# EAGLE design EOH-Badge-2016 (EAGLE 7.2.0)
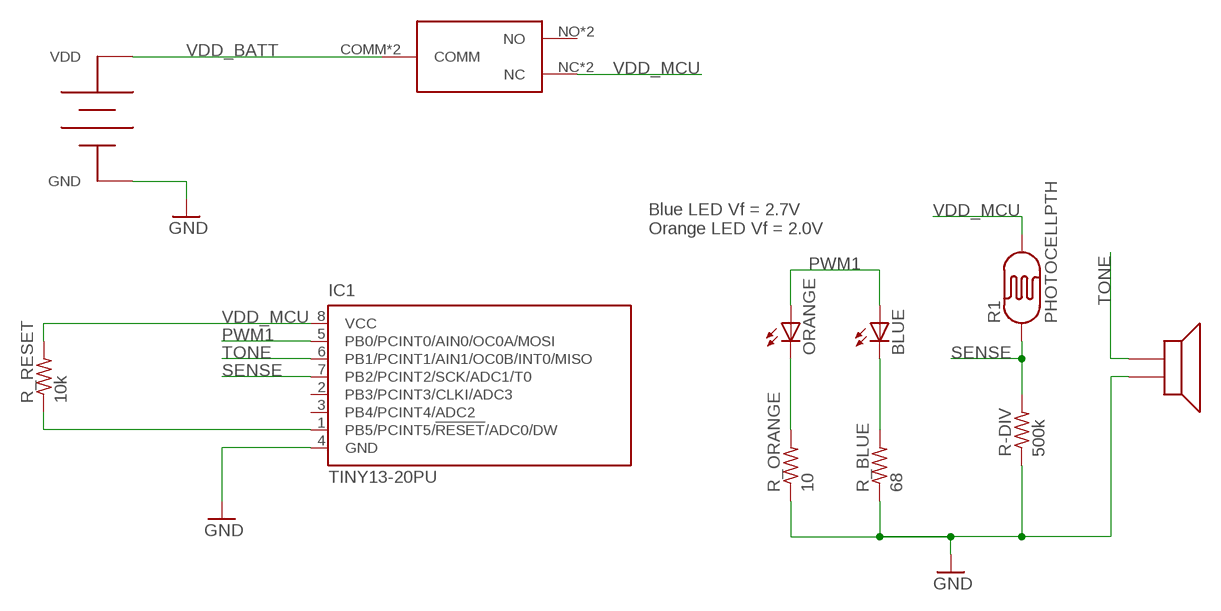
[diagram p0: schematic, sheet 1]

## Parts
BLUE  LED5MM  [LED5MM]
IC1  TINY13-20PU  [DIL08]
ORANGE  LED5MM  [LED5MM]
R1  PHOTOCELLPTH  [PHOTOCELL]
R-DIV  500k  R-US_0207/12  [0207/12]
R_BLUE  68  R-US_0207/12  [0207/12]
R_ORANGE  10  R-US_0207/12  [0207/12]
R_RESET  10k  R-US_0207/12  [0207/12]
U$1  MPD-BH32T-C  [MPD-BC2032-E2]
U$2  PIEZO  [PS1240P02BT]
U$3  EG1919-SW  [EG1919-SW]

## Nets
GND: IC1.4(GND) R-DIV.1 R_BLUE.1 R_ORANGE.1 U$1.NEG(GND) U$2.GND
N$1: IC1.1(PB5/PCINT5/!RESET!/ADC0/DW) R_RESET.1
N$2: ORANGE.K(C) R_ORANGE.2
N$3: BLUE.K(C) R_BLUE.2
PWM1: BLUE.A IC1.5(PB0/PCINT0/AIN0/OC0A/MOSI) ORANGE.A
SENSE: IC1.7(PB2/PCINT2/SCK/ADC1/T0) R1.1 R-DIV.2
TONE: IC1.6(PB1/PCINT1/AIN1/OC0B/INT0/MISO) U$2.AUDIO
VDD_BATT: U$1.POS(VDD) U$3.COMM U$3.COMM2(COMM)
VDD_MCU: IC1.8(VCC) R1.2 R_RESET.2 U$3.NC U$3.NC2(NC)
Unconnected: IC1.2(PB3/PCINT3/CLKI/ADC3) IC1.3(PB4/PCINT4/ADC2) U$3.NO U$3.NO2(NO)

## Notes on the sheet
- Blue LED Vf = 2.7V
  Orange LED Vf = 2.0V

## Library data of the parts
BLUE ORANGE = led:LED: LED OSRAM: - CHIPLED LG R971, LG N971, LY N971, LG Q971, LY Q971, LO R971, LY R971 LH N974, LH R974 LS Q976, LO Q976, LY Q976 LO Q996 - Hyper CHIPLED LW Q18S LB Q993, LB Q99A, LB R99A - SideLED LS A670, LO A670, LY A670, LG A670, LP A670 LB A673, LV A673, LT A673, LW A673 LH A674 LY A675 LS A676, LA A676, LO A676, LY A676, LW A676 LS A679, LY A679, LG A679 - Hyper Micro SIDELED® LS Y876, LA Y876, LO Y876, LY Y876 LT Y87S - SmartLED LW L88C, LW L88S LB L89C, LB L89S, LG L890 LS L89K, LO L89K, LY L89K LS L896, LA L896, LO L896, LY L896 - TOPLED LS T670, LO T670, LY T670, LG T670, LP T670 LSG T670, LSP T670, LSY T670, LOP T670, LYG T670 LG T671, LOG T671, LSG T671 LB T673, LV T673, LT T673, LW T673 LH T674 LS T676, LA T676, LO T676, LY T676, LB T676, LH T676, LSB T676, LW T676 LB T67C, LV T67C, LT T67C, LS T67K, LO T67K, LY T67K, LW E67C LS E67B, LA E67B, LO E67B, LY E67B, LB E67C, LV E67C, LT E67C LW T67C LS T679, LY T679, LG T679 LS T770, LO T770, LY T770, LG T770, LP T770 LB T773, LV T773, LT T773, LW T773 LH T774 LS E675, LA E675, LY E675, LS T675 LS T776, LA T776, LO T776, LY T776, LB T776 LHGB T686 LT T68C, LB T68C - Hyper Mini TOPLED® LB M676 - Mini TOPLED Santana® LG M470 LS M47K, LO M47K, LY M47K Source: http://www.osram.convergy.de LUXEON: - LUMILED® LXK2-PW12-R00, LXK2-PW12-S00, LXK2-PW14-U00, LXK2-PW14-V00 LXK2-PM12-R00, LXK2-PM12-S00, LXK2-PM14-U00 LXK2-PE12-Q00, LXK2-PE12-R00, LXK2-PE12-S00, LXK2-PE14-T00, LXK2-PE14-U00 LXK2-PB12-K00, LXK2-PB12-L00, LXK2-PB12-M00, LXK2-PB14-N00, LXK2-PB14-P00, LXK2-PB14-Q00 LXK2-PR12-L00, LXK2-PR12-M00, LXK2-PR14-Q00, LXK2-PR14-R00 LXK2-PD12-Q00, LXK2-PD12-R00, LXK2-PD12-S00 LXK2-PH12-R00, LXK2-PH12-S00 LXK2-PL12-P00, LXK2-PL12-Q00, LXK2-PL12-R00 Source: www.luxeon.com KINGBRIGHT: KA-3528ASYC Source: www.kingbright.com
IC1 = atmel:TINY13: 8-bit AVR Microcontroller with 1K Bytes In-System Programmable Flash Source: http://www.atmel.com/dyn/resources/prod_documents/2535S.pdf; MPN: ATTINY13-20PU; OC_FARNELL: 9171550; OC_NEWARK: 96K6521
R1 = SparkFun-Sensors:PHOTOCELL: CdS photoresistor. This is a low cost way to detect light levels. Resistance decreases with more incoming light. SparkFun SKU: SEN-09088
R-DIV R_BLUE R_ORANGE R_RESET = resistor:R-US_: RESISTOR, American symbol
U$1 = eoh-16:MPD-BH32T-C
U$2 = eoh-16:PIEZO
U$3 = eoh-16:EG1919-SW

## Board
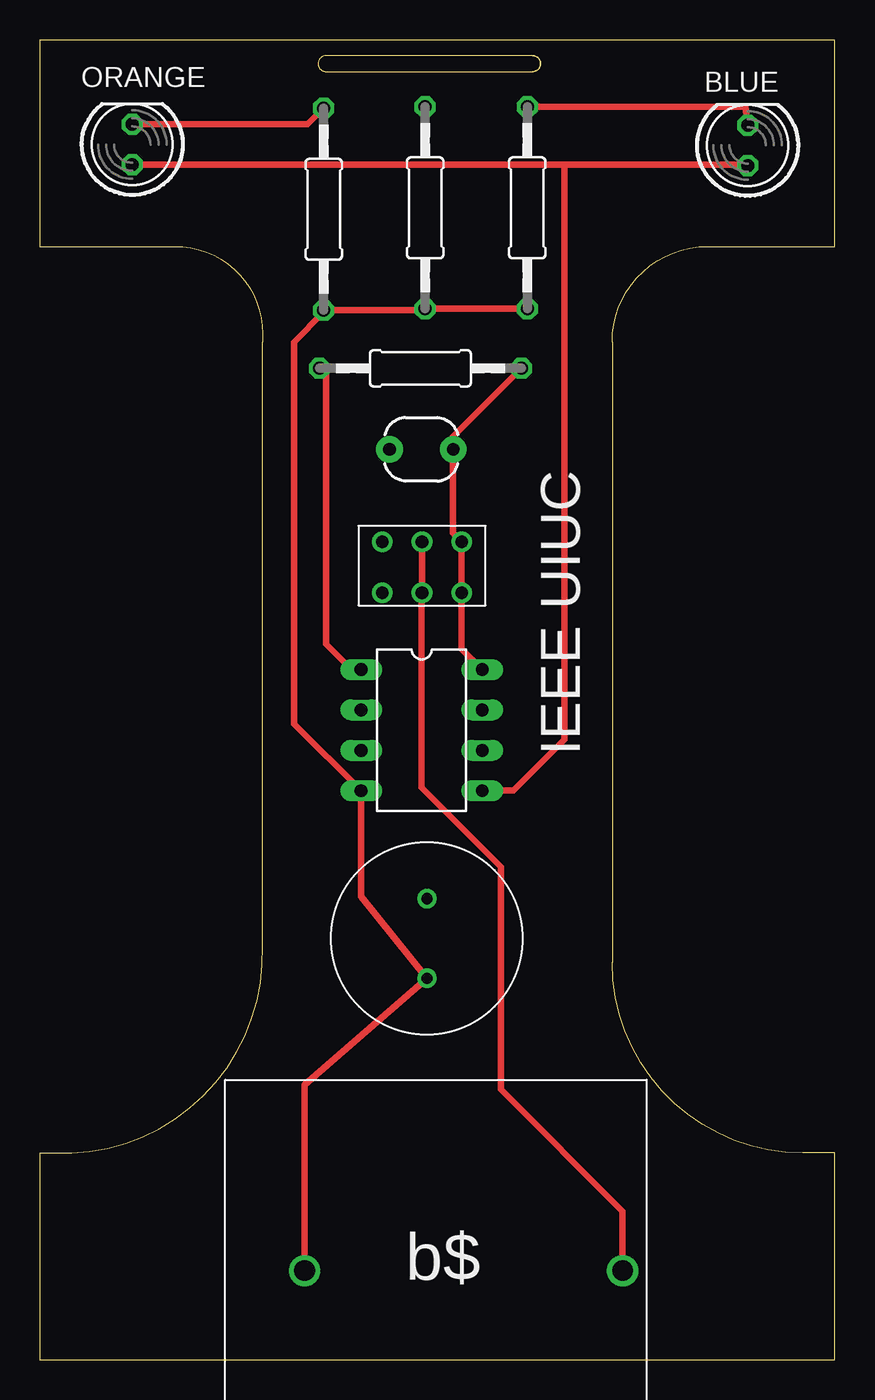
[diagram p1: board, top side]
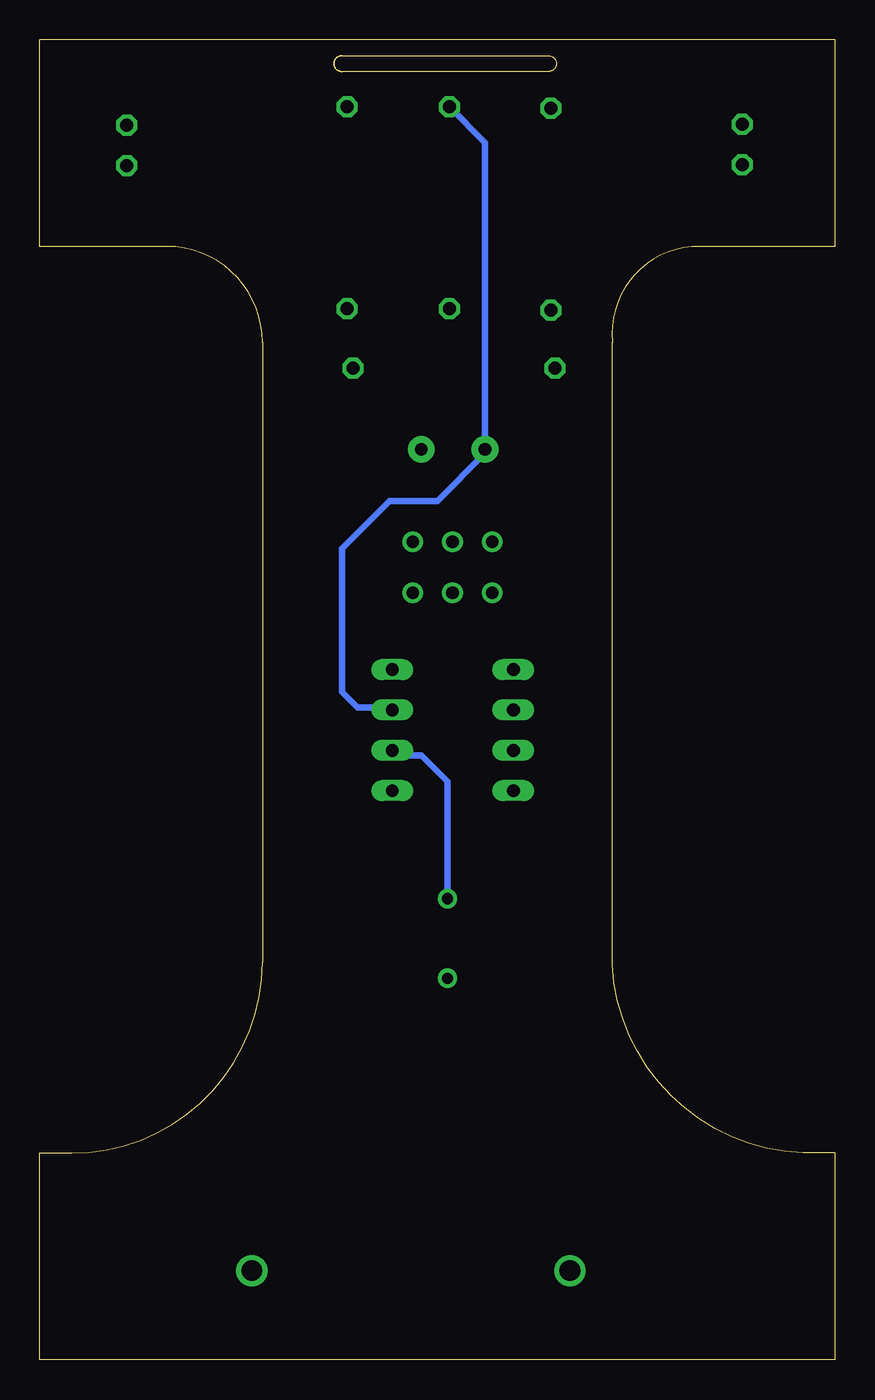
[diagram p2: board, bottom side, seen from below]

Size 50 x 83 mm. Coordinates in mm from the lower left corner, seen from the top.
Outline: 0,0 50,0 50,13 48,13 arc-90 36,25 36,64 arc-90 42,70 50,70 50,83 0,83 0,70 9,70 arc-90 14,64 14,26 arc-90 2,13 0,13 0,0
Outline: 31,82 18,82 arc180 18,81 31,81 arc180 31,82
Copper layers (1*16): Top 0.035mm / dielectric 1.5mm / Bottom 0.035mm
Design rules "default": minimum track width 10mil, minimum drill 24mil, track to track 8mil, track to pad 8mil, pad to pad 8mil, via to via 8mil, smd to smd 8mil, copper to edge 40mil, drill to drill 8mil, minimum pad ring 10mil, minimum via ring 8mil, stop-mask expansion 4mil, vias tented up to drill 0mil, thermal gap 10mil
tKeepout: area 17.5,81 to 31.5,82
tRestrict: area 17.5,81 to 31.5,82
Milling: area 17.5,81 to 31.5,82; 1 lines

### Footprints (pad centres in the part's own frame; a part is rotated, then mirrored left to right if it is on the bottom)
LED5MM = drill 0.813 octagon: A -1.27,0; K 1.27,0
DIL08 = drill 0.813 long: 1 -3.81,-3.81; 2 -1.27,-3.81; 3 1.27,-3.81; 4 3.81,-3.81; 5 3.81,3.81; 6 1.27,3.81; 7 -1.27,3.81; 8 -3.81,3.81
PHOTOCELL = drill 0.8 pad 1.676: 1 -2,0; 2 2,0
0207/12 = drill 0.813 octagon: 1 -6.35,0; 2 6.35,0
MPD-BC2032-E2 = drill 1.3: NEG 0,0; POS 0,-20
PS1240P02BT = drill 0.7: AUDIO 0,0; GND 5,0
EG1919-SW = drill 0.8: COMM 0,0; COMM2 0,-3.2; NC 2.5,0; NC2 2.5,-3.2; NO -2.5,0; NO2 -2.5,-3.2

### Placement (x,y rotation side)
BLUE  44.52,76.36 90 top
IC1  24.02,39.59 270 top
ORANGE  5.82,76.41 90 top
R1  24,57.25 0 top
R-DIV  24.24,72.43 90 top
R_BLUE  30.66,72.43 90 top
R_ORANGE  17.86,72.34 90 top
R_RESET  23.94,62.34 0 top
U$1  16.66,5.6 90 top
U$2  24.35,28.99 270 top
U$3  24.04,51.43 0 top

### Tracks (layer width: path | path; a pad name or v marks a point on that pad's centre or on a via)
GND
  Top 0.406: U$1.NEG 16.66,17.3 U$2.GND 20.21,29.13 IC1.4 16,39.99 16,64 17.86,65.86 R_ORANGE.1 24.15,65.99 R-DIV.1 R_BLUE.1
N$1
  Top 0.406: IC1.1 19.6,43.4 18,45 18,61.93 R_RESET.1
N$2
  Top 0.406: ORANGE.K 16.85,77.68 R_ORANGE.2
N$3
  Top 0.406: R_BLUE.2 44.37,78.78 BLUE.K
PWM1
  Top 0.406: ORANGE.A 33,75.14 | 33,75.14 44.47,75.14 BLUE.A | IC1.5 29.78,35.78 33,39 33,75.14
SENSE
  Bottom 0.406: IC1.7 27.97,41 30,41 31,42 31,51 28,54 25,54 22,57 R1.1 22,76.54 R-DIV.2
TONE
  Bottom 0.406: U$2.AUDIO 24.35,36.35 26,38 27.51,38 IC1.6
VDD_BATT
  Top 0.406: U$3.COMM U$3.COMM2 24,48.19 24,36 29,31 29,17 36.66,9.34 U$1.POS
VDD_MCU
  Top 0.406: R_RESET.2 26,58.05 R1.2 26,51.97 U$3.NC U$3.NC2 26.54,44.69 IC1.8

### Text on the board
tOrigins: ECE | EOH / 2016
tNames: IEEE UIUC | b$